# Altium schematic sheet Boris_IO_1.SchDoc: Boris IO
size A4; Date: 2017.12.10; DrawnBy: Miklós Árpád; Revision: 1.0; SheetNumber: 1; SheetTotal: 5; PageSetup: Record=PageOptions|CenterHorizontal=True|CenterVertical=True|PrintScale=1.00|XCorrection=1.00|YCorrection=1.00|PrintKind=0|BorderSize=5000000|LeftOffset=0|BottomOffset=0|Orientation=2|PaperLength=1000|PaperWidth=1000|Scale=100|PaperSource=7|PrintQuality=-4|MediaType=1|DitherType=10|PaperKind=A4|PrintScaleMode=0; Rule: UNIONINDEX{}0[]RULEKIND{}SupplyNets[]NETSCOPE{}AnyNet[]LAYERKIND{}SameLayer[]NAME{}Schematic Supply Nets[]VOLTAGE{}0,000[]UNIT{}Metric[]PcbType{}ProtelPcb
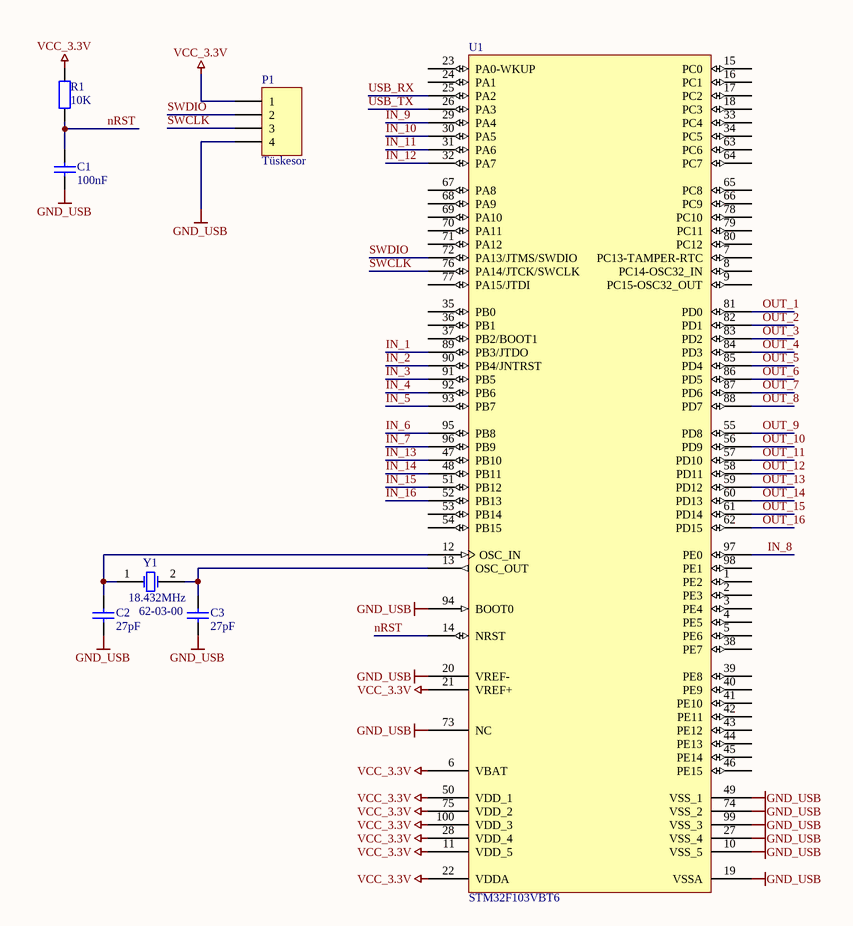
[diagram p0: Boris_IO_1.SchDoc]

## Parts
C1  100nF  [0805_CAP]
C2  27pF  [0805_CAP]
C3  27pF  [0805_CAP]
P1  Tüskesor  [HDR1X4_2.54mmp]
R1  10K  [0805_RES]
U1  STM32F103VBT6  [LQFP100_N]
Y1  18.432MHz  Catalog Number: 62-03-00  [SMU4]

## Nets
GND_USB: C1.2 C2.1 C3.1 P1.4 U1.10(VSS_5) U1.19(VSSA) U1.20(VREF-) U1.27(VSS_4) U1.49(VSS_1) U1.73(NC) U1.74(VSS_2) U1.94(BOOT0) U1.99(VSS_3)
VCC_3.3V: P1.1 R1.2 U1.6(VBAT) U1.11(VDD_5) U1.21(VREF+) U1.22(VDDA) U1.28(VDD_4) U1.50(VDD_1) U1.75(VDD_2) U1.100(VDD_3)
IN_1: U1.89(PB3/JTDO)
IN_2: U1.90(PB4/JNTRST)
IN_3: U1.91(PB5)
IN_4: U1.92(PB6)
IN_5: U1.93(PB7)
IN_6: U1.95(PB8)
IN_7: U1.96(PB9)
IN_8: U1.97(PE0)
IN_9: U1.29(PA4)
IN_10: U1.30(PA5)
IN_11: U1.31(PA6)
IN_12: U1.32(PA7)
IN_13: U1.47(PB10)
IN_14: U1.48(PB11)
IN_15: U1.51(PB12)
IN_16: U1.52(PB13)
nRST: C1.1 R1.1 U1.14(NRST)
OUT_1: U1.81(PD0)
OUT_2: U1.82(PD1)
OUT_3: U1.83(PD2)
OUT_4: U1.84(PD3)
OUT_5: U1.85(PD4)
OUT_6: U1.86(PD5)
OUT_7: U1.87(PD6)
OUT_8: U1.88(PD7)
OUT_9: U1.55(PD8)
OUT_10: U1.56(PD9)
OUT_11: U1.57(PD10)
OUT_12: U1.58(PD11)
OUT_13: U1.59(PD12)
OUT_14: U1.60(PD13)
OUT_15: U1.61(PD14)
OUT_16: U1.62(PD15)
SWCLK: P1.3 U1.76(PA14/JTCK/SWCLK)
SWDIO: P1.2 U1.72(PA13/JTMS/SWDIO)
USB_RX: U1.25(PA2)
USB_TX: U1.26(PA3)
NetC2_2: C2.2 U1.12(OSC_IN) Y1.1(OSC1)
NetC3_2: C3.2 U1.13(OSC_OUT) Y1.2(OSC2)

Not connected (* = marked no-connect by the designer): U1 1(PE2) 2(PE3) 3(PE4) 4(PE5) 5(PE6) 7(PC13-TAMPER-RTC) 8(PC14-OSC32_IN) 9(PC15-OSC32_OUT) 15(PC0) 16(PC1) 17(PC2) 18(PC3) 23(PA0-WKUP) 24(PA1) 33(PC4) 34(PC5) 35(PB0) 36(PB1) 37(PB2/BOOT1) 38(PE7) 39(PE8) 40(PE9) 41(PE10) 42(PE11) 43(PE12) 44(PE13) 45(PE14) 46(PE15) 53(PB14) 54(PB15) 63(PC6) 64(PC7) 65(PC8) 66(PC9) 67(PA8) 68(PA9) 69(PA10) 70(PA11) 71(PA12) 77(PA15/JTDI) 78(PC10) 79(PC11) 80(PC12) 98(PE1)

## Notes on the sheet
- Title:
- Date:
- SheetNumber:
- Document Name:
- SheetTotal:
- Revison:
- DrawnBy:
- Size:
- A4

## Library data of the parts
C1-C3 = Cap: Capacitor; Distributor: RET
  C1: Value: 100nF; Catalog Number: 93-04-28; Name: 100nF
  C2 C3: Value: 27pF; Catalog Number: 93-01-45; Name: 27pF
P1 = Header 4: Header, -Pin; Distributor: RET; Name: Tüskesor; Catalog Number: 53-00-04
R1 = Res2: Resistor; Value: 10K; Catalog Number: 92-02-23; Distributor: RET; Name: 10K
U1 = STM32F103VBT6: STM32 ARM-based 32-bit MCU with 64 Kbytes Flash, 100-pin LQFP, Industrial Temperature; Published: 30-May-2008; DatasheetVersion: rev6, Mar-2008; PackageVersion: Mar-2008; PackageReference: LQFP100; Publisher: Altium Limited; PackageDescription: 100-Pin Low-Profile Quad Flat Pack, 14 x 14 mm Body, 0.5 mm Pitch (LQFP100); ComponentLink1Description: Manufacturer Link; ComponentLink1URL: www.st.com/stm32; ComponentLink2Description: Datasheet; ComponentLink2URL: http://www.st.com/stonline/products/literature/ds/13587.pdf
Y1 = XTAL: Crystal Oscillator; Distributor: RET; Name: ="Value" + Crystal; Value: 18.432MHz